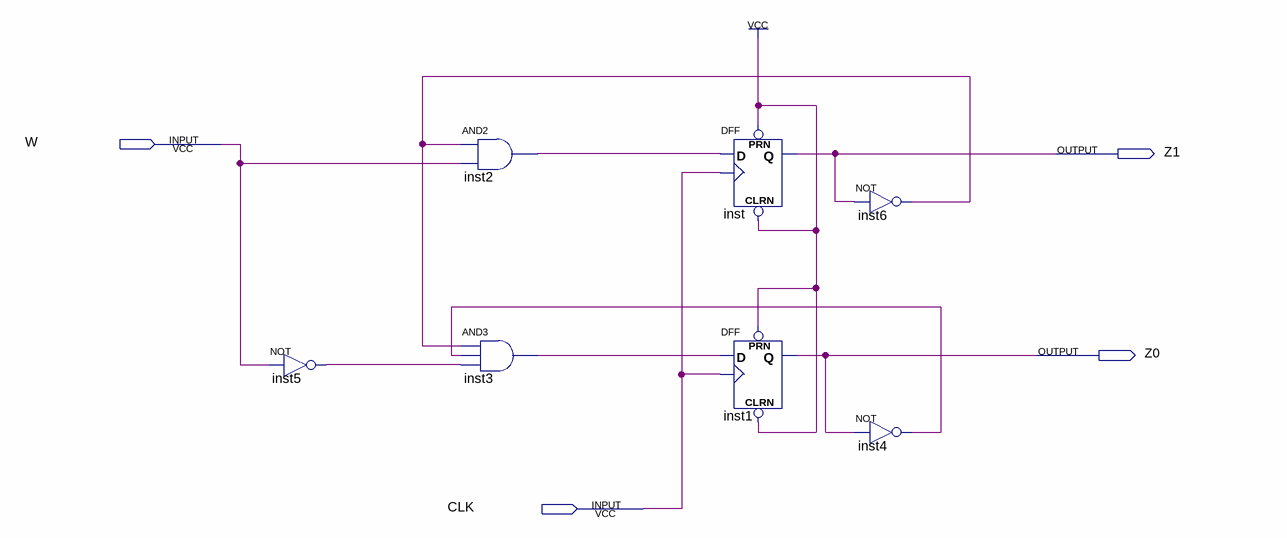
[diagram p0: schematic sheet]
// Quartus schematic FSM.bdf as structural Verilog: 7 symbols, 4 pins
module FSM (
  input  W,
  input  CLK,
  output Z1,
  output Z0
);

  wire inst2_out, inst3_out, inst4_out, inst5_out, inst6_out;

  not inst5 (inst5_out, W);
  and inst2 (inst2_out, inst6_out, W);
  and inst3 (inst3_out, inst6_out, inst4_out, inst5_out);
  DFF inst (.CLRN(1'b1), .CLK(CLK), .D(inst2_out), .PRN(1'b1), .Q(Z1));
  DFF inst1 (.CLRN(1'b1), .CLK(CLK), .D(inst3_out), .PRN(1'b1), .Q(Z0));
  not inst6 (inst6_out, Z1);
  not inst4 (inst4_out, Z0);
endmodule
